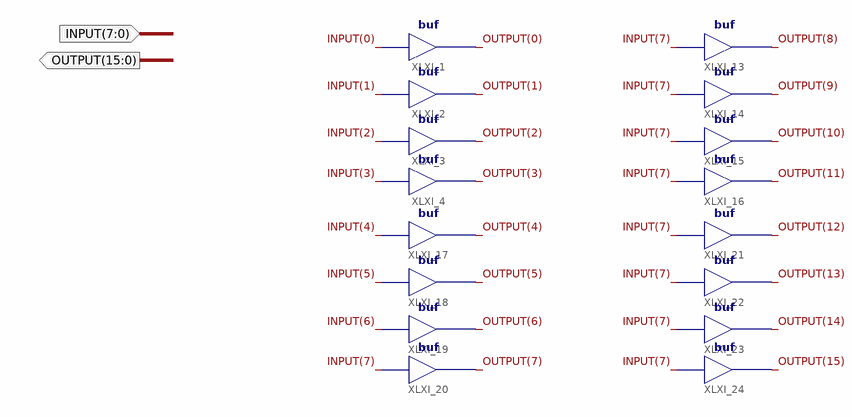
[diagram p0: schematic sheet 1]
// Xilinx ISE schematic SE.sch (spartan3e) as structural Verilog: 16 symbols, 2 ports
module SE (
  input  [7:0] INPUT,
  output [15:0] OUTPUT
);

  buf XLXI_1 (OUTPUT[0], INPUT[0]);
  buf XLXI_2 (OUTPUT[1], INPUT[1]);
  buf XLXI_3 (OUTPUT[2], INPUT[2]);
  buf XLXI_4 (OUTPUT[3], INPUT[3]);
  buf XLXI_13 (OUTPUT[8], INPUT[7]);
  buf XLXI_14 (OUTPUT[9], INPUT[7]);
  buf XLXI_15 (OUTPUT[10], INPUT[7]);
  buf XLXI_16 (OUTPUT[11], INPUT[7]);
  buf XLXI_17 (OUTPUT[4], INPUT[4]);
  buf XLXI_18 (OUTPUT[5], INPUT[5]);
  buf XLXI_19 (OUTPUT[6], INPUT[6]);
  buf XLXI_20 (OUTPUT[7], INPUT[7]);
  buf XLXI_21 (OUTPUT[12], INPUT[7]);
  buf XLXI_22 (OUTPUT[13], INPUT[7]);
  buf XLXI_23 (OUTPUT[14], INPUT[7]);
  buf XLXI_24 (OUTPUT[15], INPUT[7]);
endmodule
